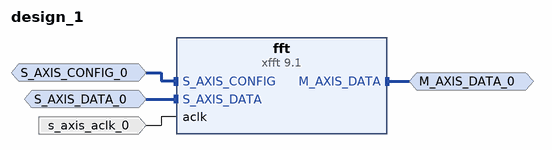
[diagram p0: block diagram of the top level]
# Vivado block design design_1, xc7z010clg400-1, Vivado 2018.1
create_bd_design design_1

create_bd_intf_port -mode Slave -vlnv xilinx.com:interface:axis_rtl:1.0 S_AXIS_CONFIG_0
set_property -dict [list \
  CONFIG.TDATA_NUM_BYTES 2 \
  CONFIG.TDEST_WIDTH 0 \
  CONFIG.TID_WIDTH 0 \
  CONFIG.TUSER_WIDTH 0 \
  CONFIG.HAS_TREADY 1 \
  CONFIG.HAS_TSTRB 0 \
  CONFIG.HAS_TKEEP 0 \
  CONFIG.HAS_TLAST 0 \
  CONFIG.LAYERED_METADATA undef \
] [get_bd_intf_ports S_AXIS_CONFIG_0]
create_bd_intf_port -mode Slave -vlnv xilinx.com:interface:axis_rtl:1.0 S_AXIS_DATA_0
set_property -dict [list \
  CONFIG.TDATA_NUM_BYTES 4 \
  CONFIG.TDEST_WIDTH 0 \
  CONFIG.TID_WIDTH 0 \
  CONFIG.TUSER_WIDTH 0 \
  CONFIG.HAS_TREADY 1 \
  CONFIG.HAS_TSTRB 0 \
  CONFIG.HAS_TKEEP 0 \
  CONFIG.HAS_TLAST 1 \
  CONFIG.LAYERED_METADATA undef \
] [get_bd_intf_ports S_AXIS_DATA_0]
create_bd_intf_port -mode Master -vlnv xilinx.com:interface:axis_rtl:1.0 M_AXIS_DATA_0
create_bd_port -dir I -type clk s_axis_aclk_0

create_bd_cell -type ip -vlnv xilinx.com:ip:xfft:9.1 fft
set_property -dict [list \
  CONFIG.transform_length 64 \
  CONFIG.target_clock_frequency 250 \
  CONFIG.implementation_options automatically_select \
  CONFIG.target_data_throughput 250 \
  CONFIG.data_format fixed_point \
  CONFIG.input_width 16 \
  CONFIG.phase_factor_width 15 \
  CONFIG.scaling_options scaled \
  CONFIG.rounding_modes truncation \
  CONFIG.throttle_scheme nonrealtime \
  CONFIG.output_ordering natural_order \
  CONFIG.cyclic_prefix_insertion false \
  CONFIG.number_of_stages_using_block_ram_for_data_and_phase_factors 0 \
] [get_bd_cells fft]

# ---- connections ----

connect_bd_intf_net -intf_net S_AXIS_CONFIG_0_1 [get_bd_intf_ports S_AXIS_CONFIG_0] [get_bd_intf_pins fft/S_AXIS_CONFIG]
connect_bd_intf_net -intf_net S_AXIS_DATA_0_1 [get_bd_intf_ports S_AXIS_DATA_0] [get_bd_intf_pins fft/S_AXIS_DATA]
connect_bd_intf_net [get_bd_intf_ports M_AXIS_DATA_0] [get_bd_intf_pins fft/M_AXIS_DATA]
connect_bd_net -net s_axis_aclk_0_1 [get_bd_ports s_axis_aclk_0] [get_bd_pins fft/aclk]

validate_bd_design
save_bd_design
